# Altium schematic sheet Flash&PSRAM.SchDoc
size Letter; SheetNumber: 5; SheetTotal: 5
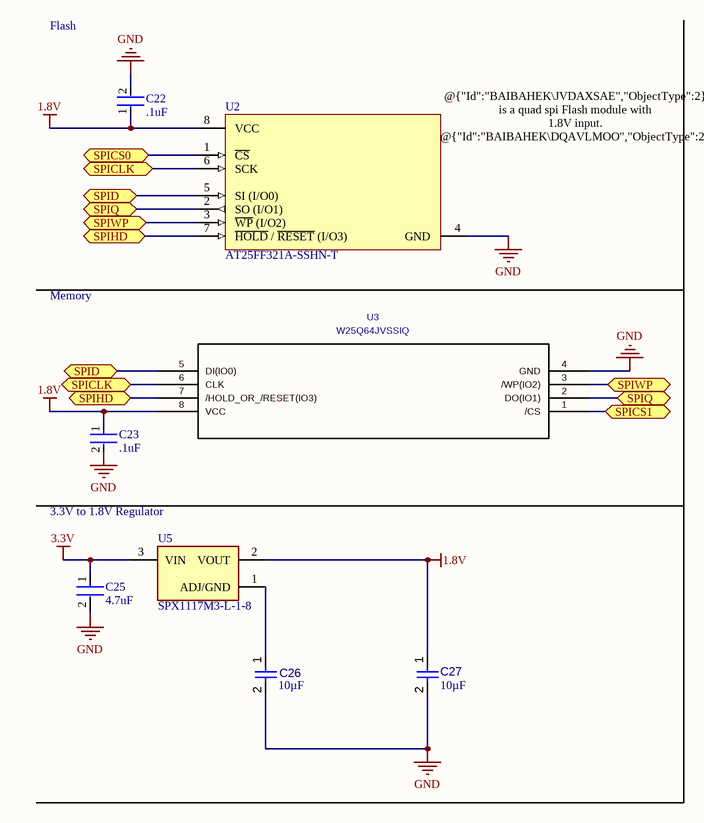
[diagram p0: Flash&PSRAM.SchDoc]

## Parts
C22  .1uF  [FP-GRM033-0_03-IPC_A]
C23  .1uF  [FP-GRM033-0_03-IPC_A]
C25  4.7uF  [FP-RDE3P1-MFG]
C26  value 10µF  [CAPC0603(1608)100_L]  (hidden comment: 10uF)
C27  value 10µF  [CAPC0603(1608)100_L]  (hidden comment: 10uF)
U2  AT25FF321A-SSHN-T  [M8_15_MFG]
U3  W25Q64JVSSIQ  [SOIC127P790X216-8N]
U5  SPX1117M3-L-1-8  [SOT230P700X180-3N]

## Ports
SPICLK (bidir), SPICS0 (bidir), SPICS1 (bidir), SPID (bidir), SPIHD (bidir), SPIQ (bidir), SPIWP (bidir)

## Nets
1.8V: C22.1 C23.1 C27.1 U2.8(VCC) U3.8(VCC) U5.2(VOUT)
3.3V: C25.1 U5.3(VIN)
GND: C22.2 C23.2 C25.2 C26.2 C27.2 U2.4(GND) U3.4(GND)
SPICLK: U2.6(SCK) U3.6(CLK) ; port SPICLK
SPICS0: U2.1(~{CS}) ; port SPICS0
SPICS1: U3.1(/CS) ; port SPICS1
SPID: U2.5(SI_(I/O0)) U3.5(DI(IO0)) ; port SPID
SPIHD: U2.7(~{HOLD}_/_~{RESET}_(I/O3)) U3.7(/HOLD_OR_/RESET(IO3)) ; port SPIHD
SPIQ: U2.2(SO_(I/O1)) U3.2(DO(IO1)) ; port SPIQ
SPIWP: U2.3(~{WP}_(I/O2)) U3.3(/WP(IO2)) ; port SPIWP
NetC26_1: C26.1 U5.1(ADJ/GND)

## Notes on the sheet
- Flash
- @{"Id":"BAIBAHEK\JVDAXSAE","ObjectType":2} is a quad spi Flash module with 1.8V input. @{"Id":"BAIBAHEK\DQAVLMOO","ObjectType":2} is a quad spi PSRAM module with 1.8V input
- Memory
- 3.3V to 1.8V Regulator

## Library data of the parts
C22 C23 = CMP-06035-043202-1: Chip Multilayer Ceramic Capacitors for General Purpose, 0201, 0.10uF, X7R, 15%, 10%, 16V
C25 = CMP-00260-148573962-1: RDEC72A475K3P1H03B; Voltage Rating: 100V; Material: Ceramic; Capacitance: 4.7µF; Tolerance: 10%; Case/Package: Radial; Height: 7.5mm; Lifecycle Status: Production; Min Operating Temperature: -55°C; Max Operating Temperature: 125°C
C26 C27 = CMP-001-00075-4: Chip Capacitor, 10µF +/-20%, 10V, 0603, Thickness 1 mm; Tolerance: 10%; Voltage Rating: 10V; Max Operating Temperature: 85°C; Pins: 2; Case/Package: 0603; Mounting Technology: SMT; Min Operating Temperature: -55°C
U2 = CMP-00572-125972999-1: 32Mbit, 1.65 V to 3.6 V SPI Serial Flash Memory with Multi-I/O Support; Manufacturer Lifecycle Status: ACTIVE; Pitch: 1.27mm; ComponentLink2URL: https://octopart.com/cad-content/api/get-model-datasheet/15189/125972999; ComponentLink1Description: Manufacturer's Website; Export Control Classification Number (ECCN) Code: 3A991; ComponentLink1URL: http://www.renesas.com; Package Quantity: 4000; ComponentLink3Description: Manufacturer's Package Drawing; ComponentLink3URL: https://www.renesas.com/en/document/psc/m815-8-lead-narrow-body-small-outline-plastic-package; Harmonized Tariff Schedule (HTS) Code: 8542.32.00.51; Packaging: Tape & Reel; RoHS: Compliant; Part Family: AT25FF321A; MSL: 1; HelpURL: https://octopart.com/cad-content/api/get-model-datasheet/15189/125972999; ComponentLink2Description: Datasheet URL; Lifecycle Status: Production
U3 = W25Q64JVSSIQ: FLASH - NOR Memory IC 64Mbit SPI - Quad I/O 133 MHz 8-SOIC; Manufacturer_Name: Winbond; C: Copyright (C) 2018 Accelerated Designs. All rights reserved; Value: W25Q64JVSSIQ; Copyright: Copyright (C) 2025 Ultra Librarian. All rights reserved.; Manufacturer_Part_Number: W25Q64JVSSIQ
U5 = CMP-031-00006-1: Linear Voltage Regulator IC Positive Fixed 1 Output 800mA SOT-223-3; MF: MaxLinear, Inc.; MP: SPX1117M3-L-1-8/TR; Source: SPX1117M3-L-1-8.SchLib; SnapEDA_Link: https://www.snapeda.com/parts/SPX1117M3-L-1-8/TR/MaxLinear/view-part/?ref=snap; Case/Package: SOT-223 MaxLinear; Design Item ID: SPX1117M3-L-1-8; Component Type: Standard; Check_prices: https://www.snapeda.com/parts/SPX1117M3-L-1-8/TR/MaxLinear/view-part/?ref=eda; Pins: 3; Value: *